# Altium schematic sheet ESP_Main_ERC.SchDoc
size A1; SheetNumber: 1; SheetTotal: 2
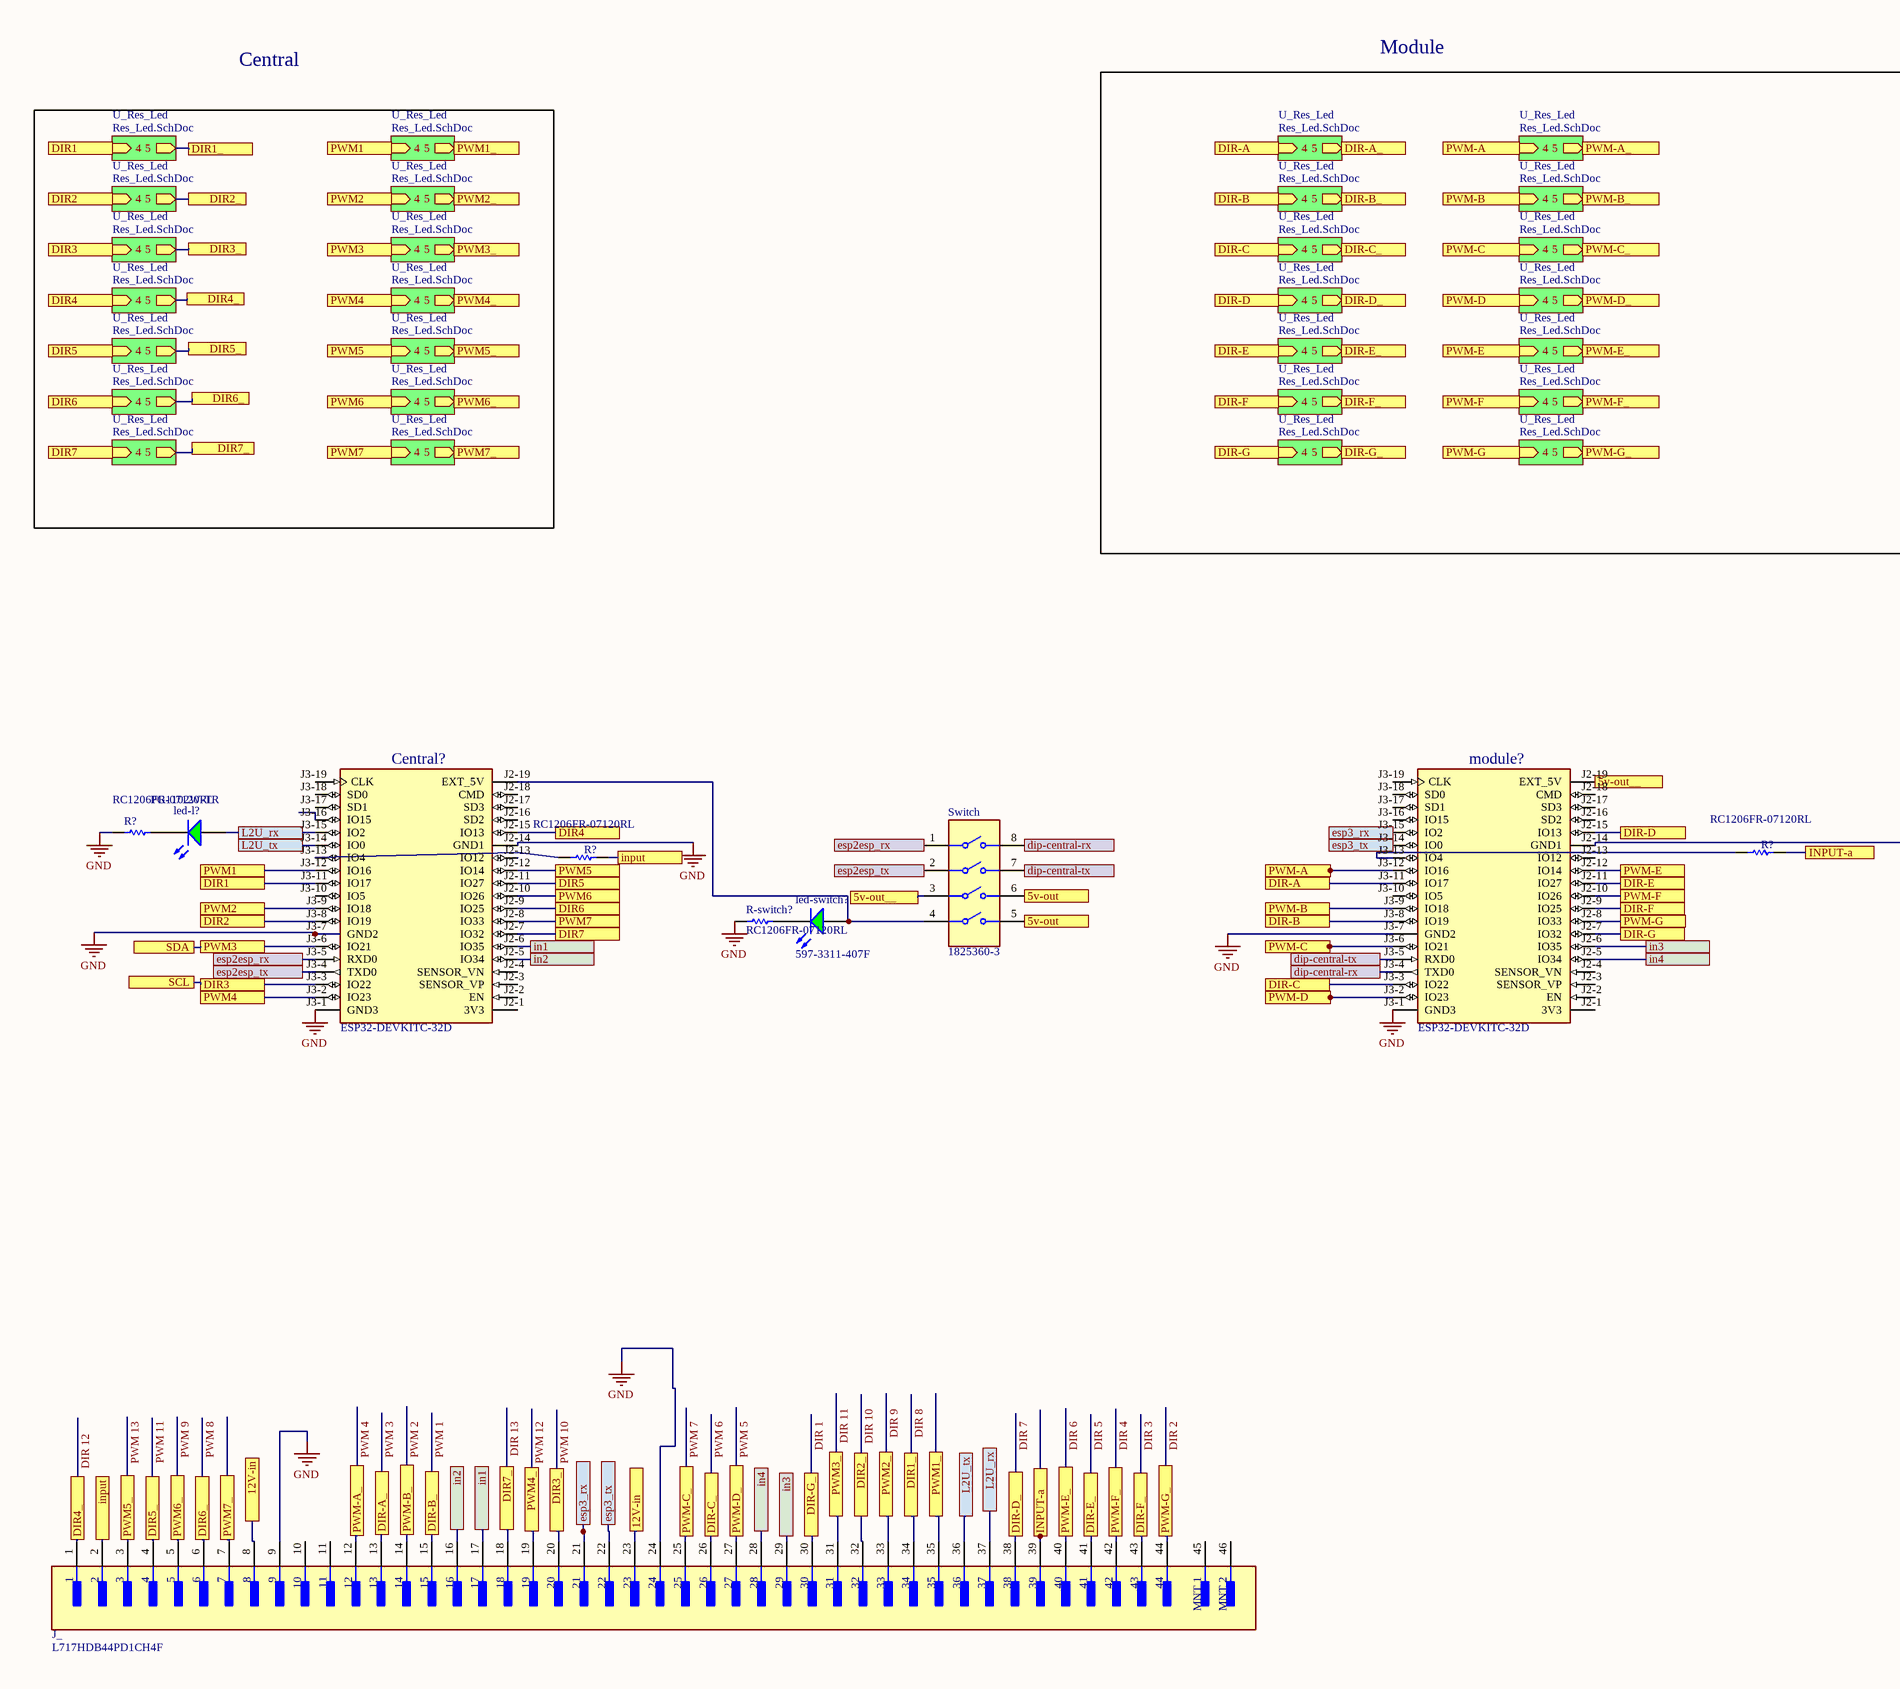
[diagram p0: ESP_Main_ERC.SchDoc, left]
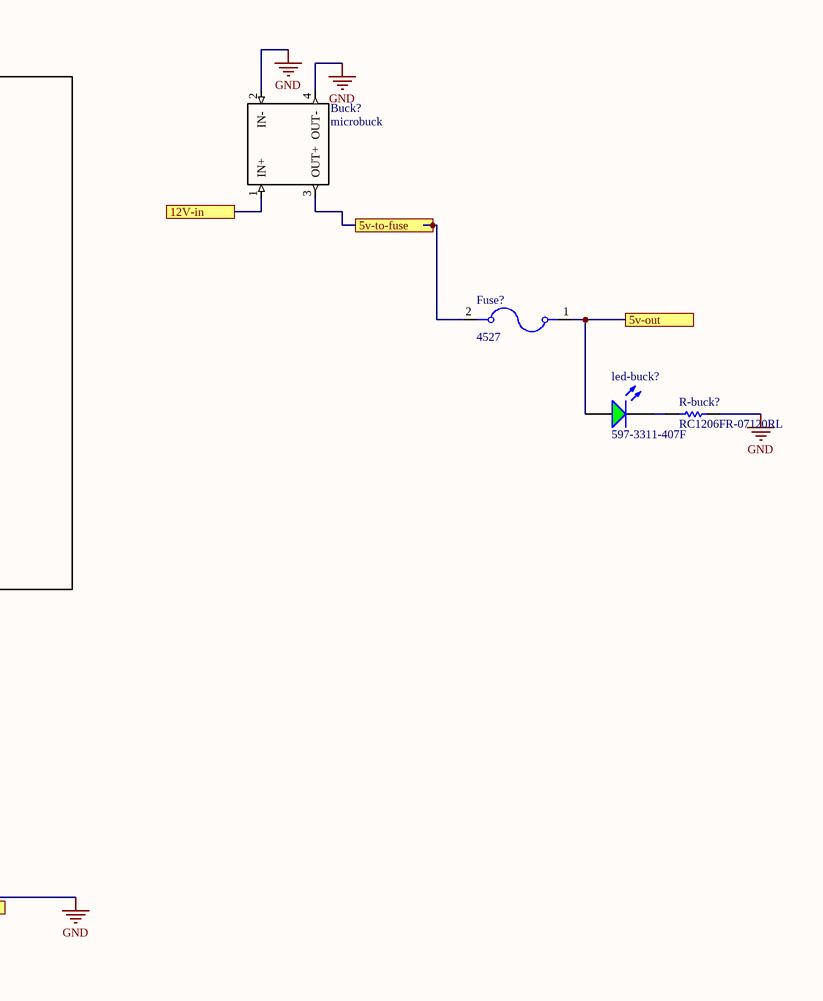
[diagram p1: ESP_Main_ERC.SchDoc, right]

## Parts
(Parts that share a designator on the sheet are numbered #1, #2 ... from top to bottom, then left to right.)
Buck?  microbuck  [Micro buck]
Central?  ESP32-DEVKITC-32D  [MODULE_ESP32-DEVKITC-32D]
Fuse?  4527  [FUSE_4527]
J_  L717HDB44PD1CH4F  [FP-L717HDB44PD1CH4F-MFG]
led-buck?  597-3311-407F  [DIAL-597-3311-407F_V]
led-l?  PG1102W-TR  [STEC-1102W_V]
led-switch?  597-3311-407F  [DIAL-597-3311-407F_V]
module?  ESP32-DEVKITC-32D  [MODULE_ESP32-DEVKITC-32D]
R-buck?  RC1206FR-07120RL  [RESC3116X65X40LL10T20]
R-switch?  RC1206FR-07120RL  [RESC3116X65X40LL10T20]
R?#1  RC1206FR-07120RL  [RESC3116X65X40LL10T20]
R?#2  RC1206FR-07120RL  [RESC3116X65X40LL10T20]
R?#3  RC1206FR-07120RL  [RESC3116X65X40LL10T20]
Switch  1825360-3  [FP-1825360-3-MFG]

## Sub-sheets
U_Res_Led = Res_Led.SchDoc: 4 (in), 5 (out)
U_Res_Led = Res_Led.SchDoc: 4 (in), 5 (out)
U_Res_Led = Res_Led.SchDoc: 4 (in), 5 (out)
U_Res_Led = Res_Led.SchDoc: 4 (in), 5 (out)
U_Res_Led = Res_Led.SchDoc: 4 (in), 5 (out)
U_Res_Led = Res_Led.SchDoc: 4 (in), 5 (out)
U_Res_Led = Res_Led.SchDoc: 4 (in), 5 (out)
U_Res_Led = Res_Led.SchDoc: 4 (in), 5 (out)
U_Res_Led = Res_Led.SchDoc: 4 (in), 5 (out)
U_Res_Led = Res_Led.SchDoc: 4 (in), 5 (out)
U_Res_Led = Res_Led.SchDoc: 4 (in), 5 (out)
U_Res_Led = Res_Led.SchDoc: 4 (in), 5 (out)
U_Res_Led = Res_Led.SchDoc: 4 (in), 5 (out)
U_Res_Led = Res_Led.SchDoc: 4 (in), 5 (out)
U_Res_Led = Res_Led.SchDoc: 4 (in), 5 (out)
U_Res_Led = Res_Led.SchDoc: 4 (in), 5 (out)
U_Res_Led = Res_Led.SchDoc: 4 (in), 5 (out)
U_Res_Led = Res_Led.SchDoc: 4 (in), 5 (out)
U_Res_Led = Res_Led.SchDoc: 4 (in), 5 (out)
U_Res_Led = Res_Led.SchDoc: 4 (in), 5 (out)
U_Res_Led = Res_Led.SchDoc: 4 (in), 5 (out)
U_Res_Led = Res_Led.SchDoc: 4 (in), 5 (out)
U_Res_Led = Res_Led.SchDoc: 4 (in), 5 (out)
U_Res_Led = Res_Led.SchDoc: 4 (in), 5 (out)
U_Res_Led = Res_Led.SchDoc: 4 (in), 5 (out)
U_Res_Led = Res_Led.SchDoc: 4 (in), 5 (out)
U_Res_Led = Res_Led.SchDoc: 4 (in), 5 (out)
U_Res_Led = Res_Led.SchDoc: 4 (in), 5 (out)

## Ports
5v-out, 5v-out__, 5v-to-fuse, 12V-in, dip-central-rx, dip-central-tx, DIR1, DIR1_, DIR2, DIR2_, DIR3, DIR3_, DIR4, DIR4_, DIR5, DIR5_, DIR6, DIR6_, DIR7, DIR7_, DIR-A, DIR-A_, DIR-B, DIR-B_, DIR-C, DIR-C_, DIR-D, DIR-D_, DIR-E, DIR-E_, DIR-F, DIR-F_, DIR-G, DIR-G_, esp2esp_rx, esp2esp_tx, esp3_rx, esp3_tx, in1, in2, in3, in4, input, INPUT-a, L2U_rx, L2U_tx, PWM1, PWM1_, PWM2, PWM2_, PWM3, PWM3_, PWM4, PWM4_, PWM5, PWM5_, PWM6, PWM6_, PWM7, PWM7_, PWM-A, PWM-A_, PWM-B, PWM-B_, PWM-C, PWM-C_, PWM-D, PWM-D_, PWM-E, PWM-E_, PWM-F, PWM-F_, PWM-G, PWM-G_, SCL, SDA

## Nets
GND: Buck?.2(IN-) Buck?.4(OUT-) Central?.J2-14(GND1) Central?.J3-1(GND3) Central?.J3-7(GND2) J_.9 J_.24 module?.J2-14(GND1) module?.J3-1(GND3) module?.J3-7(GND2) R-buck?.2 R-switch?.1 R?#1.1
5v-out: Fuse?.1 led-buck?.1(A) Switch.5 Switch.6 ; port 5v-out
5v-out__: module?.J2-19(EXT_5V) Switch.3 ; port 5v-out__
5v-to-fuse: Buck?.3(OUT+) Fuse?.2 ; port 5v-to-fuse
12V-in: Buck?.1(IN+) J_.8 J_.23 ; port 12V-in
dip-central-rx: module?.J3-4(TXD0) Switch.8 ; port dip-central-rx
dip-central-tx: module?.J3-5(RXD0) Switch.7 ; port dip-central-tx
DIR1: Central?.J3-11(IO17) ; port DIR1, sheet U_Res_Led/4
DIR2: Central?.J3-8(IO19) ; port DIR2, sheet U_Res_Led/4
DIR3: Central?.J3-3(IO22) ; port DIR3, port SCL, sheet U_Res_Led/4
DIR4: Central?.J2-15(IO13) ; port DIR4, sheet U_Res_Led/4
DIR5: Central?.J2-11(IO27) ; port DIR5, sheet U_Res_Led/4
DIR6: Central?.J2-9(IO25) ; port DIR6, sheet U_Res_Led/4
DIR7: Central?.J2-7(IO32) ; port DIR7, sheet U_Res_Led/4
DIR 1: J_.30 ; port DIR-G_, sheet U_Res_Led/5
DIR 2: J_.44 ; port PWM-G_, sheet U_Res_Led/5
DIR 3: J_.43 ; port DIR-F_, sheet U_Res_Led/5
DIR 4: J_.42 ; port PWM-F_, sheet U_Res_Led/5
DIR 5: J_.41 ; port DIR-E_, sheet U_Res_Led/5
DIR 6: J_.40 ; port PWM-E_, sheet U_Res_Led/5
DIR 7: J_.38 ; port DIR-D_, sheet U_Res_Led/5
DIR 8: J_.34 ; port DIR1_, sheet U_Res_Led/5
DIR 9: J_.33 ; port PWM2_, sheet U_Res_Led/5
DIR 10: J_.32 ; port DIR2_, sheet U_Res_Led/5
DIR 11: J_.31 ; port PWM3_, sheet U_Res_Led/5
DIR 12: J_.1 ; port DIR4_, sheet U_Res_Led/5
DIR 13: J_.18 ; port DIR7_, sheet U_Res_Led/5
DIR-A: module?.J3-11(IO17) ; port DIR-A, sheet U_Res_Led/4
DIR-B: module?.J3-8(IO19) ; port DIR-B, sheet U_Res_Led/4
DIR-C: module?.J3-3(IO22) ; port DIR-C, sheet U_Res_Led/4
DIR-D: module?.J2-15(IO13) ; port DIR-D, sheet U_Res_Led/4
DIR-E: module?.J2-11(IO27) ; port DIR-E, sheet U_Res_Led/4
DIR-F: module?.J2-9(IO25) ; port DIR-F, sheet U_Res_Led/4
DIR-G: module?.J2-7(IO32) ; port DIR-G, sheet U_Res_Led/4
esp2esp_rx: Central?.J3-5(RXD0) Switch.1 ; port esp2esp_rx
esp2esp_tx: Central?.J3-4(TXD0) Switch.2 ; port esp2esp_tx
esp3_rx: J_.21 module?.J3-15(IO2) ; port esp3_rx
esp3_tx: J_.22 module?.J3-14(IO0) ; port esp3_tx
in1: Central?.J2-6(IO35) J_.17 ; port in1
in2: Central?.J2-5(IO34) J_.16 ; port in2
in3: J_.29 module?.J2-6(IO35) ; port in3
in4: J_.28 module?.J2-5(IO34) ; port in4
input: J_.2 R?#2.2 ; port input
INPUT-a: J_.39 R?#3.2 ; port INPUT-a
L2U_rx: Central?.J3-15(IO2) J_.37 led-l?.1(A) ; port L2U_rx
L2U_tx: Central?.J3-14(IO0) J_.36 ; port L2U_tx
PWM1: Central?.J3-12(IO16) ; port PWM1, sheet U_Res_Led/4
PWM1_: J_.35 ; port PWM1_, sheet U_Res_Led/5
PWM2: Central?.J3-9(IO18) ; port PWM2, sheet U_Res_Led/4
PWM3: Central?.J3-6(IO21) ; port PWM3, port SDA, sheet U_Res_Led/4
PWM4: Central?.J3-2(IO23) ; port PWM4, sheet U_Res_Led/4
PWM5: Central?.J2-12(IO14) ; port PWM5, sheet U_Res_Led/4
PWM6: Central?.J2-10(IO26) ; port PWM6, sheet U_Res_Led/4
PWM7: Central?.J2-8(IO33) ; port PWM7, sheet U_Res_Led/4
PWM7_: J_.7 ; port PWM7_, sheet U_Res_Led/5
PWM 1: J_.15 ; port DIR-B_, sheet U_Res_Led/5
PWM 2: J_.14 ; port PWM-B_, sheet U_Res_Led/5
PWM 3: J_.13 ; port DIR-A_, sheet U_Res_Led/5
PWM 4: J_.12 ; port PWM-A_, sheet U_Res_Led/5
PWM 5: J_.27 ; port PWM-D_, sheet U_Res_Led/5
PWM 6: J_.26 ; port DIR-C_, sheet U_Res_Led/5
PWM 7: J_.25 ; port PWM-C_, sheet U_Res_Led/5
PWM 8: J_.6 ; port DIR6_, sheet U_Res_Led/5
PWM 9: J_.5 ; port PWM6_, sheet U_Res_Led/5
PWM 10: J_.20 ; port DIR3_, sheet U_Res_Led/5
PWM 11: J_.4 ; port DIR5_, sheet U_Res_Led/5
PWM 12: J_.19 ; port PWM4_, sheet U_Res_Led/5
PWM 13: J_.3 ; port PWM5_, sheet U_Res_Led/5
PWM-A: module?.J3-12(IO16) ; port PWM-A, sheet U_Res_Led/4
PWM-B: module?.J3-9(IO18) ; port PWM-B, sheet U_Res_Led/4
PWM-C: module?.J3-6(IO21) ; port PWM-C, sheet U_Res_Led/4
PWM-D: module?.J3-2(IO23) ; port PWM-D, sheet U_Res_Led/4
PWM-E: module?.J2-12(IO14) ; port PWM-E, sheet U_Res_Led/4
PWM-F: module?.J2-10(IO26) ; port PWM-F, sheet U_Res_Led/4
PWM-G: module?.J2-8(IO33) ; port PWM-G, sheet U_Res_Led/4
NetCentral?_J2-19: Central?.J2-19(EXT_5V) led-switch?.1(A) Switch.4
NetCentral?_J3-13: Central?.J3-13(IO4) R?#2.1
Netled-buck?_2: led-buck?.2(K) R-buck?.1
Netled-l?_2: led-l?.2(K) R?#1.2
Netled-switch?_2: led-switch?.2(K) R-switch?.2
Netmodule?_J3-13: module?.J3-13(IO4) R?#3.1

Not connected (* = marked no-connect by the designer): Central? J2-1(3V3) J2-2(EN) J2-3(SENSOR_VP) J2-4(SENSOR_VN) J2-13(IO12) J2-16(SD2) J2-17(SD3) J2-18(CMD) J3-10(IO5) J3-16(IO15) J3-17(SD1) J3-18(SD0) J3-19(CLK); J_ 10 11 45(MNT_1) 46(MNT_2); module? J2-1(3V3) J2-2(EN) J2-3(SENSOR_VP) J2-4(SENSOR_VN) J2-13(IO12) J2-16(SD2) J2-17(SD3) J2-18(CMD) J3-10(IO5) J3-16(IO15) J3-17(SD1) J3-18(SD0) J3-19(CLK)

## Notes on the sheet
- Central
- Module

## Library data of the parts
Central? module? = ESP32-DEVKITC-32D: WiFi Development Tools (802.11) ESP32 General Development Kit, ESP32-WROOM-32D on the board; MF: Espressif Systems; SnapEDA_Link: https://www.snapeda.com/parts/ESP32-DEVKITC-32D/Espressif+Systems/view-part/?ref=snap; Package: None; Value: *; MP: ESP32-DEVKITC-32D; Check_prices: https://www.snapeda.com/parts/ESP32-DEVKITC-32D/Espressif+Systems/view-part/?ref=eda
Fuse? = 4527: Fuseholder; 5 A; 250 V; Nylon; Base only; Brass, Tin Plate (Contact); Value: *; MP: 4527; Package: None; Availability: Unavailable; Price: None
J_ = CMP-02362-000001-1: CONN DSUB HD PLUG 44POS R/A SLDR; Current Rating: 3A; Body Material: Steel; Number of Contacts: 44; Connector Type: D-Sub; Number of Ports: 1; Gender: Male; Voltage Rating: 250V; Width: 12.55mm; Contact Plating: Gold; Max Operating Temperature: 105°C; Number of Terminals: 44; Length: 53.09mm; Number of Rows: 3; Number of Positions: 44; Min Operating Temperature: -55°C; Orientation: Right Angle; Packaging: Tray; Package Quantity: 50; Termination: Solder; Depth: 22.22mm; Housing Material: Thermoplastic; Mount: Through Hole; Contact Material: Brass
led-buck? led-switch? = CMP-2000-05651-1: LED Green, 75 mW, 30 mA, -30 to 85 degC, 2-Pin SMD, RoHS, Tape and Reel; Manufacturer: Dialight; Product Depth (mm): 1.5mm; Viewing Angle: 70deg; DELETED: Compliant; Number of  Elements: 1; Emitting Color: YellowGreen; Shape Type: Rectangular; Product Length (mm): 3mm; Forward Current: 30mA; Main Category: ChipLED; Luminous Intensity: 7.5mcd; High Brightness: No; Test Current (It): 20mA; Lens Type: NonDiffused; Reverse Voltage: 4V; Peak Wavelength: 560nm; Power Dissipation: 75W; Forward Voltage: 2.5V; Chip Material: GaP; Mounting: SurfaceMount; Product Height (mm): 1.5mm; Pin Count: 2; Type: Uni-Color; Datasheet URL: https://datasheet.ciiva.com/15117/getdatasheetpartid-142484-15117764.pdf; Mounting Technology: SurfaceMount; Rad Hardened: No; Operating Temperature Classification: Commercial; Lens Dimensions: 2x1.5x0.9mm; Operating Temp Range: -30Cto85C; Package Reference: 597-3311-407F; Package Type: SMD; Datasheet Version: 07/2002; Lum Intensity: 7.5mcd; Packaging: TapeandReel; Package Description: 2-Pin Surface Mount Device, Body 1.5 x 3 mm; Manufacturer URL: http://www.dialight.com/
led-l? = CMP-2000-06890-1: Green LED, 567 nm, 2.1 V, 30 mA, -30 to 85 degC, 2-Pin SMD, RoHS, Tape and Reel; Manufacturer: Stanley Electric; Viewing Angle: 69/85deg; High Brightness: No; Number of  Elements: 1; Peak Wavelength: 560nm; Forward Current: 30mA; Test Current (It): 20mA; Main Category: ChipLED; Dominant Wave Length: 567nm; Power Dissipation: 75W; Lum Intensity: 12mcd; Shape Type: Rectangular; Chip Material: GaP; Reverse Voltage: 4V; Product Depth (mm): 1.5mm; Forward Voltage: 2.5V; Product Length (mm): 3mm; DELETED: Compliant; Emitting Color: YellowGreen; Operating Temp Range: -30Cto85C; Datasheet URL: http://media.digikey.com/pdf/Data%20Sheets/Stanley%20Electric%20PDFs/1102W_Series.pdf; Packaging: TapeandReel; Package Reference: 1102W; Manufacturer URL: http://www.stanley-electric.com/; Package Description: 2-Pin Surface Mounted Device , Body 3 x 1.5 mm; Type: Uni-Color; Rad Hardened: No; Mounting Technology: SurfaceMount; Package Type: SMD; Operating Temperature Classification: Commercial; Product Height (mm): 1.5mm; Pin Count: 2; Lens Dimensions: 2x1.5x0.9mm; Datasheet Version: 08/2007; Mounting: SurfaceMount; Luminous Intensity: 12mcd
R-buck? R-switch? R?#1-R?#3 = CMP-2000-06965-1: Chip Resistor, 120 Ohm, +/- 1%, 250 mW, -55 to 155 degC, 1206 (3216 Metric), RoHS, Tape and Reel; Manufacturer: Yageo; Resistor Element Type: ThickFilm; Resistance: 120ohm; Voltage Rating: 200V; Temperature Coefficient: ±100ppm/°C; Power Rating: 250mW; Product Range: RCSeries; SVHC: ToBeAdvised; Resistor Case Style: 1206[3216Metric]; Package Reference: 1206; Resistance Tolerance: ±1%; Package Description: 2-Pin Surface Mount Device, Body 3.1 x 1.6 mm; Manufacturer URL: http://www.yageo.com/; MSL: MSL1-Unlimited; Packaging: CutTape; Datasheet URL: http://www.yageo.com/documents/recent/PYu-RC_Group_51_RoHS_L_7.pdf; Mounting Technology: SurfaceMount; Datasheet Version: Rev. 7, 05/2017
Switch = CMP-03400-000022-1: SWITCH SLIDE DIP SPST 100MA 24V; Washable: Yes; Contact Current Rating: 1A; Electrical Life: 1000Cycles; Number of Circuits: 4; Pitch: 0.1inch; Actuator Length: 0.99mm; Contact Resistance: 50mR; Actuator Type: Standard; Contact Post Length: 4mm; Voltage Rating (DC): 5V; Actuator Material: Polybutylene; Sealable: No (Without); Max Voltage Rating (DC): 24V; Throw Configuration: SPST; Mount: Through Hole; Type: Switch; RoHS Compliant: Yes; Min Operating Temperature: -30°C; Max Operating Temperature: 85°C; Orientation: Straight; Packaging: Rail/Tube; Series: ADE; Lead Free: Lead Free; Depth: 7.49mm; Flammability Rating: UL94 V-0; Radiation Hardening: No; Terminal Pitch: 2.54mm; Package Quantity: 35; Contact Material: Copper Alloy; Housing Color: Black; Number of Positions: 4; Length: 0.476inch; ELV: Compliant; Termination: PC Pins; Housing Material: Polyphenylene; Contact Plating: Gold; Max Current Rating: 100mA; Height: 0.138inch